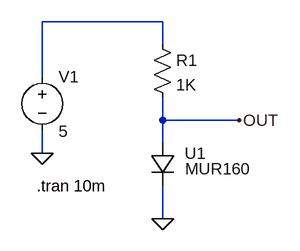
[diagram p0: schematic MUR160.asc]
MUR160.asc, the LTspice schematic file:
Version 4.1
SHEET 1 880 680
WIRE 176 80 0 80
WIRE 176 112 176 80
WIRE 0 160 0 80
WIRE 176 224 176 192
WIRE 288 224 176 224
WIRE 176 256 176 224
WIRE 0 272 0 240
WIRE 176 368 176 320
FLAG 176 368 0
FLAG 0 272 0
FLAG 288 224 OUT
SYMBOL voltage 0 144 R0
WINDOW 123 0 0 Left 0
WINDOW 39 0 0 Left 0
SYMATTR InstName V1
SYMATTR Value 5
SYMBOL res 160 96 R0
SYMATTR InstName R1
SYMATTR Value 1K
SYMBOL MyLib\\Diode\\MUR160 160 256 R0
SYMATTR InstName U1
TEXT -8 320 Left 2 !.tran 10m

The netlist it stands for:
* MUR160.asc
V1 N001 0 5
R1 N001 OUT 1K
X§U1 OUT 0 MUR160  ; pins + -
.tran 10m
.lib MyLib/Diode/MUR160.lib
.backanno
.end